# EAGLE design probatio-rotary-16leds_3535 (EAGLE 9.6.2)
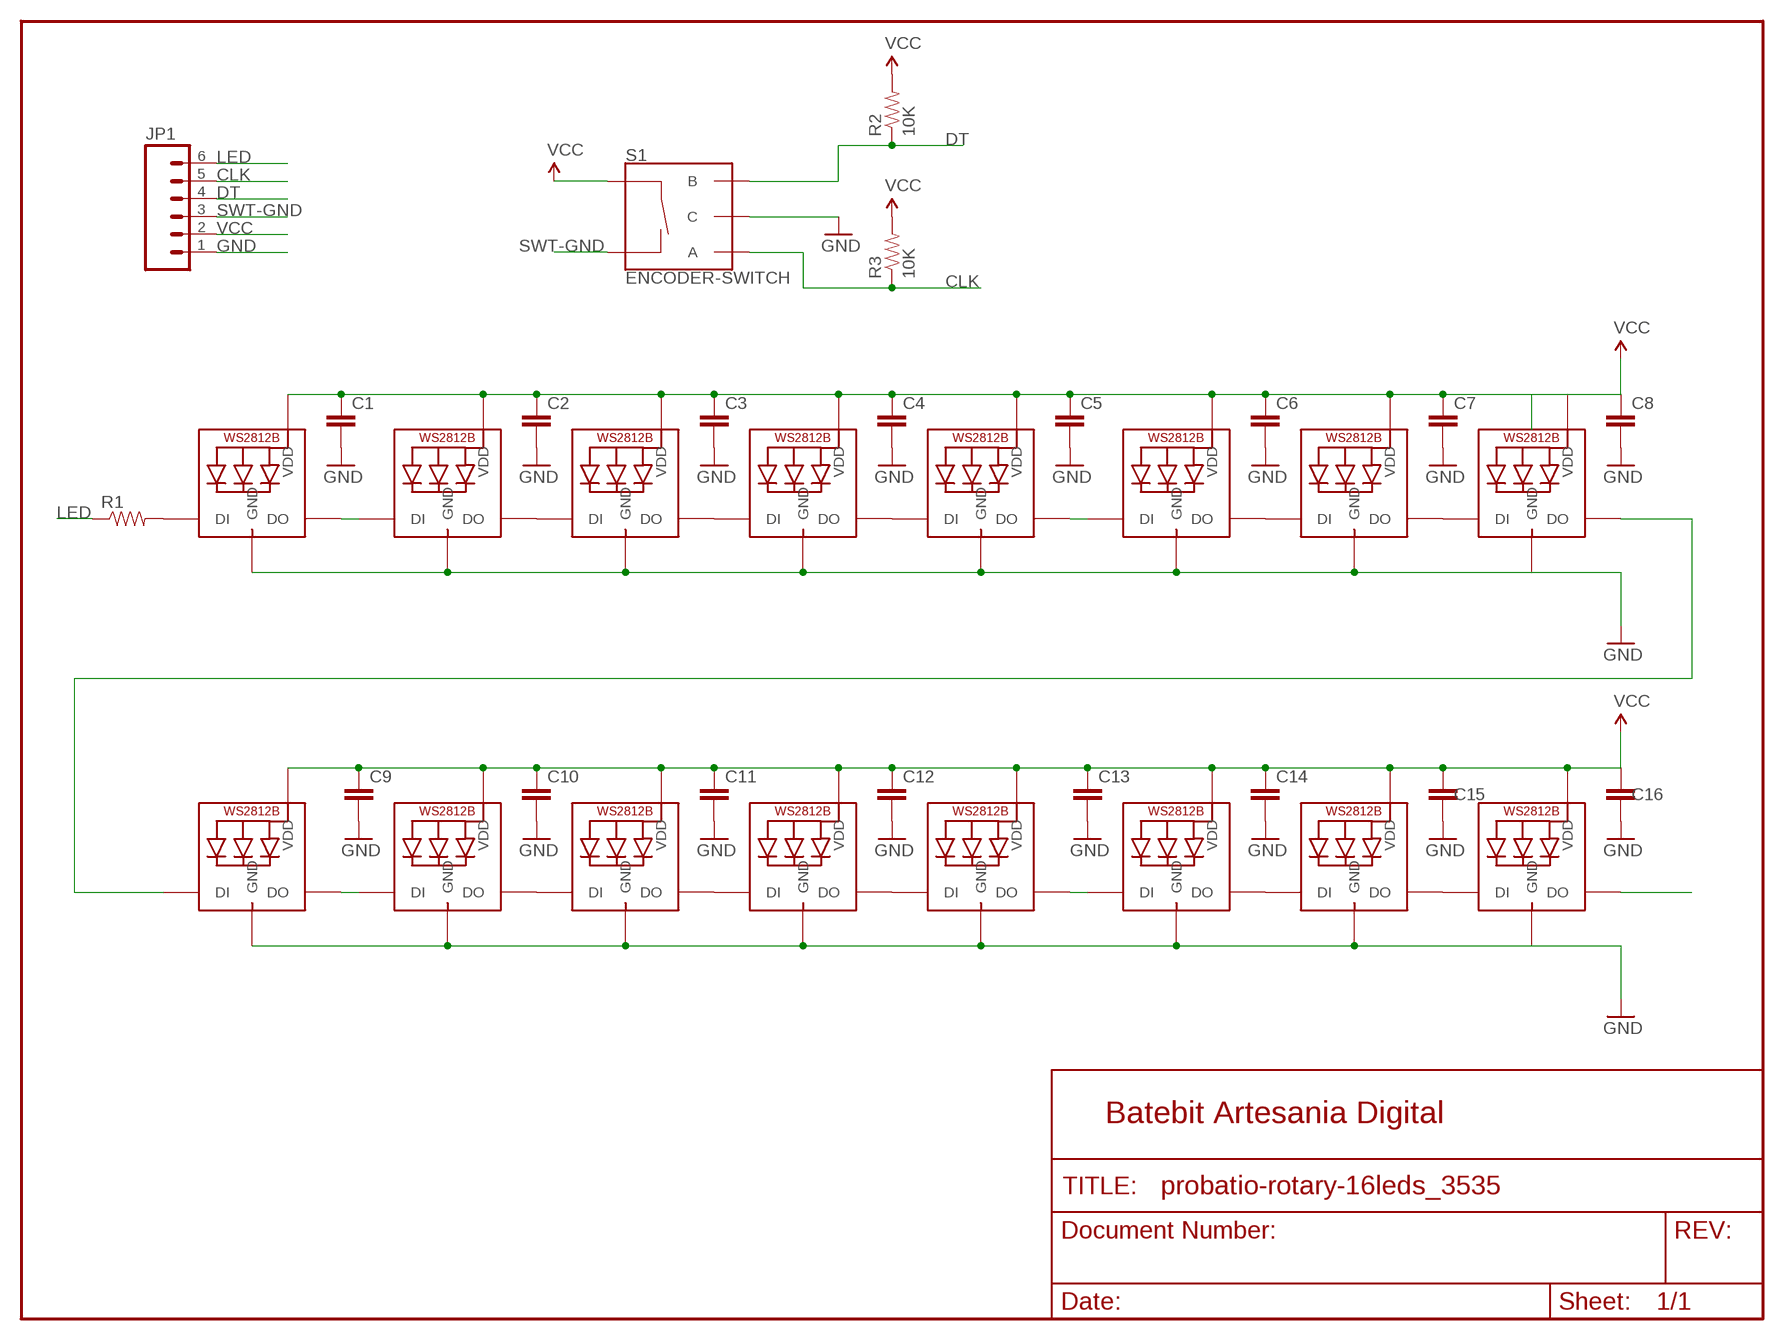
[diagram p0: schematic, sheet 1]

## Parts
C1  CAP0805-CAP  [0805-CAP]
C2  CAP0805-CAP  [0805-CAP]
C3  CAP0805-CAP  [0805-CAP]
C4  CAP0805-CAP  [0805-CAP]
C5  CAP0805-CAP  [0805-CAP]
C6  CAP0805-CAP  [0805-CAP]
C7  CAP0805-CAP  [0805-CAP]
C8  CAP0805-CAP  [0805-CAP]
C9  CAP0805-CAP  [0805-CAP]
C10  CAP0805-CAP  [0805-CAP]
C11  CAP0805-CAP  [0805-CAP]
C12  CAP0805-CAP  [0805-CAP]
C13  CAP0805-CAP  [0805-CAP]
C14  CAP0805-CAP  [0805-CAP]
C15  CAP0805-CAP  [0805-CAP]
C16  CAP0805-CAP  [0805-CAP]
JP1  M06SILK_FEMALE_PTH  [1X06]
LED1  WS2812B3535  [LED3535]
LED2  WS2812B3535  [LED3535]
LED3  WS2812B3535  [LED3535]
LED4  WS2812B3535  [LED3535]
LED5  WS2812B3535  [LED3535]
LED6  WS2812B3535  [LED3535]
LED7  WS2812B3535  [LED3535]
LED8  WS2812B3535  [LED3535]
LED9  WS2812B3535  [LED3535]
LED10  WS2812B3535  [LED3535]
LED11  WS2812B3535  [LED3535]
LED12  WS2812B3535  [LED3535]
LED13  WS2812B3535  [LED3535]
LED14  WS2812B3535  [LED3535]
LED15  WS2812B3535  [LED3535]
LED16  WS2812B3535  [LED3535]
R1  RESISTOR0805-RES  [0805-RES]
R2  10K  RESISTOR0805-RES  [0805-RES]
R3  10K  RESISTOR0805-RES  [0805-RES]
S1  ENCODER-SWITCH  [ROTARY_ENC_PLAIN]

## Nets
CLK: JP1.5 R3.1 S1.A
DT: JP1.4 R2.1 S1.B
GND [Power]: C1.2 C2.2 C3.2 C4.2 C5.2 C6.2 C7.2 C8.2 C9.2 C10.2 C11.2 C12.2 C13.2 C14.2 C15.2 C16.2 JP1.1 LED1.4(GND) LED2.4(GND) LED3.4(GND) LED4.4(GND) LED5.4(GND) LED6.4(GND) LED7.4(GND) LED8.4(GND) LED9.4(GND) LED10.4(GND) LED11.4(GND) LED12.4(GND) LED13.4(GND) LED14.4(GND) LED15.4(GND) LED16.4(GND) S1.C
LED: JP1.6 R1.1
N$1: LED1.3(DO) LED2.1(DI)
N$2: LED2.3(DO) LED3.1(DI)
N$3: LED3.3(DO) LED4.1(DI)
N$4: LED5.3(DO) LED6.1(DI)
N$5: LED6.3(DO) LED7.1(DI)
N$6: LED7.3(DO) LED8.1(DI)
N$7: LED4.3(DO) LED5.1(DI)
N$8: LED9.3(DO) LED10.1(DI)
N$9: LED10.3(DO) LED11.1(DI)
N$10: LED11.3(DO) LED12.1(DI)
N$11: LED13.3(DO) LED14.1(DI)
N$12: LED14.3(DO) LED15.1(DI)
N$13: LED15.3(DO) LED16.1(DI)
N$14: LED12.3(DO) LED13.1(DI)
N$15: LED8.3(DO) LED9.1(DI)
N$16: LED16.3(DO)
N$17: LED1.1(DI) R1.2
SWT-GND: JP1.3 S1.SW-
VCC [Power]: C1.1 C2.1 C3.1 C4.1 C5.1 C6.1 C7.1 C8.1 C9.1 C10.1 C11.1 C12.1 C13.1 C14.1 C15.1 C16.1 JP1.2 LED1.2(VDD) LED2.2(VDD) LED3.2(VDD) LED4.2(VDD) LED5.2(VDD) LED6.2(VDD) LED7.2(VDD) LED8.2(VDD) LED9.2(VDD) LED10.2(VDD) LED11.2(VDD) LED12.2(VDD) LED13.2(VDD) LED14.2(VDD) LED15.2(VDD) LED16.2(VDD) R2.2 R3.2 S1.SW+

## Notes on the sheet
- Batebit Artesania Digital

## Library data of the parts
C1-C16 = Batebit:CAP: Capacitor Standard 0603 ceramic capacitor, and 0.1" leaded capacitor.
JP1 = Batebit:M06: Header 6 Standard 6-pin 0.1" header. Use with straight break away headers (SKU : PRT-00116), right angle break away headers (PRT-00553), swiss pins (PRT-00743), machine pins (PRT-00117), and female headers (PRT-00115). Molex polarized connector foot print use with SKU : PRT-08094 with associated crimp pins and housings. NOTES ON THE VARIANTS LOCK and LOCK_LONGPADS... This footprint was designed to help hold the alignment of a through-hole component (i.e. 6-pin header) while soldering it into place. You may notice that each hole has been shifted either up or down by 0.005 of an inch from it's more standard position (which is a perfectly straight line). This slight alteration caused the pins (the squares in the middle) to touch the edges of the holes. Because they are alternating, it causes a "brace" to hold the component in place. 0.005 has proven to be the perfect amount of "off-center" position when using our standard breakaway headers. Although looks a little odd when you look at the bare footprint, once you have a header in there, the alteration is very hard to notice. Also,if you push a header all the way into place, it is covered up entirely on the bottom side. This idea of altering the position of holes to aid alignment will be further integrated into the Sparkfun Library for other footprints. It can help hold any component with 3 or more connection pins.; PROD_ID: CONN-08437
LED1-LED16 = Batebit:WS2812B
R1-R3 = Batebit:RESISTOR: Resistor Basic schematic elements and footprints for 0603, 1206, and PTH resistors.
S1 = Batebit:ENCODER-SWITCH: Rotary Encoder w/ Select Switch Encoders rotate similarly to potentiometers, but they’re different from potentiometers in that an encoder has full rotation without limits. They output gray code so that you can tell how much and in which direction the encoder has been turned. This encoder includes a push-down select switch built into the shaft. SparkFun Products Rotary Encoder <https://www.sparkfun.com/products/9117> (COM-09117); SF_SKU: COM-09117

## Net classes
0 Default: width 0.254 mm, drill 0.508 mm, clearance 0.203 mm
1 Power: width 0.356 mm, drill 0.508 mm, clearance 0.254 mm
2 LEDPower: width 0.305 mm, drill 0.508 mm, clearance 0.305 mm
3 ButtonSignal: width 0.305 mm, drill 0.508 mm, clearance 0.305 mm

## Board
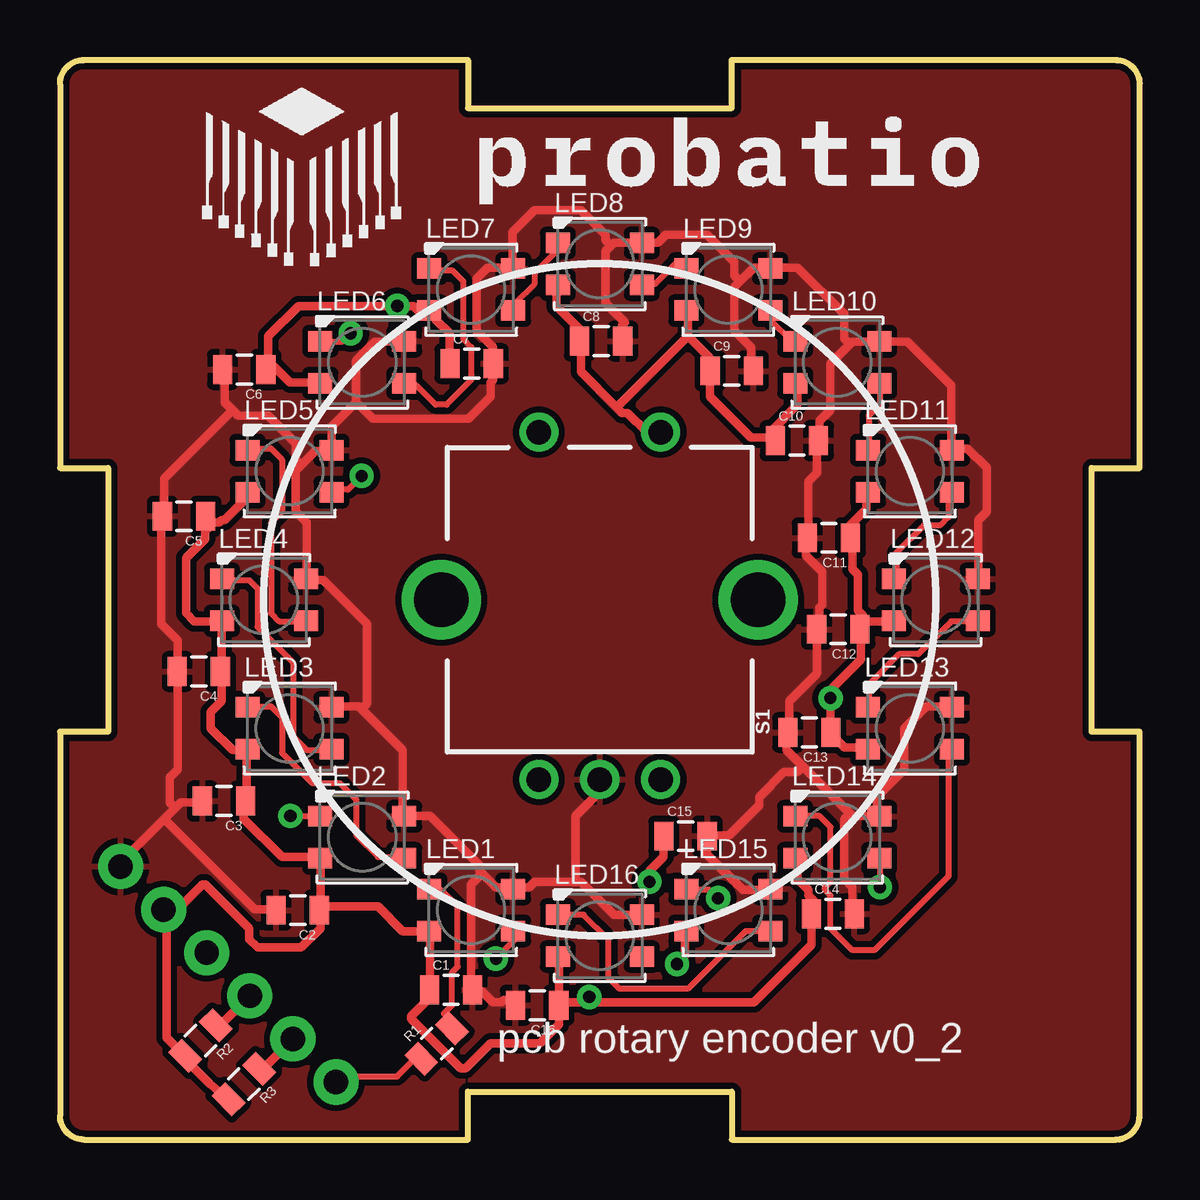
[diagram p1: board, top side]
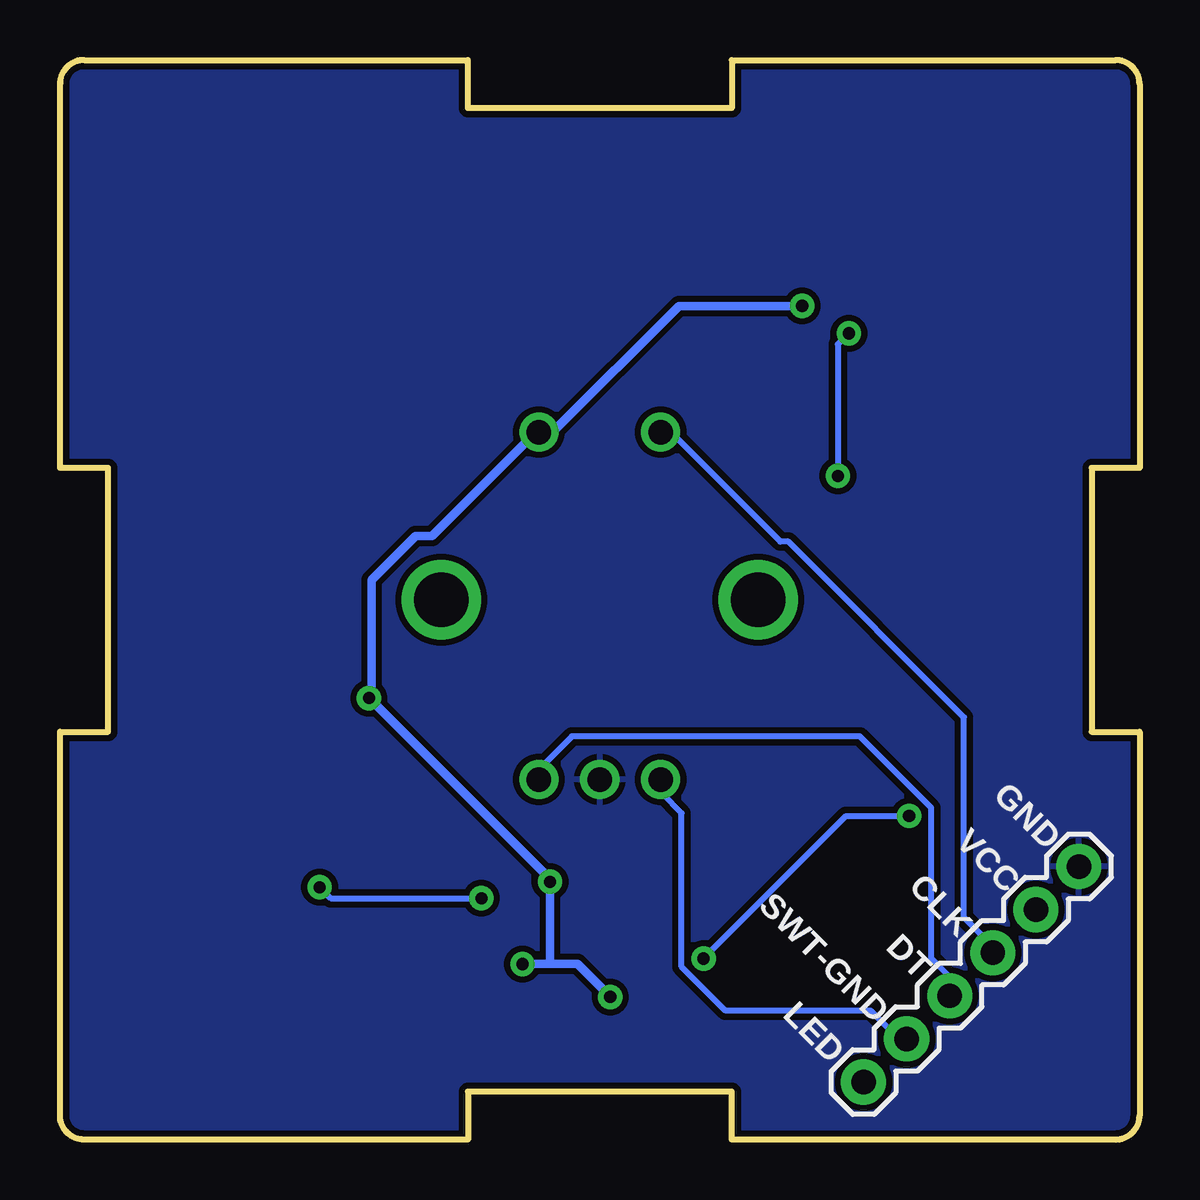
[diagram p2: board, bottom side, seen from below]

Size 45 x 45 mm. Coordinates in mm from the lower left corner, seen from the top.
Outline: 1,0 17,0 17,2 28,2 28,0 44,0 arc90 45,1 45,17 43,17 43,28 45,28 45,44 arc90 44,45 28,45 28,43 17,43 17,45 1,45 arc90 0,44 0,28 2,28 2,17 0,17 0,1 arc90 1,0
Copper layers (1*16): Top 0.035mm / dielectric 1.5mm / Bottom 0.035mm
Design rules "SparkFun": minimum track width 8mil, minimum drill 20mil, track to track 8mil, track to pad 8mil, pad to pad 8mil, via to via 8mil, smd to smd 8mil, copper to edge 10mil, drill to drill 8mil, minimum pad ring 12mil, minimum via ring 10mil, stop-mask expansion 4mil, vias tented up to drill 25mil, thermal gap 10mil

### Footprints (pad centres in the part's own frame; a part is rotated, then mirrored left to right if it is on the bottom)
0805-CAP = smd 0.8 x 1.2: 1 -0.9,0; 2 0.9,0
1X06 = drill 1.016 pad 1.88: 1 0,0; 2 2.54,0; 3 5.08,0; 4 7.62,0; 5 10.16,0; 6 12.7,0
LED3535 = smd 1 x 0.85: 1 -1.75,0.875; 2 -1.75,-0.875; 3 1.75,-0.875; 4 1.75,0.875
0805-RES = smd 0.8 x 1.2: 1 -0.9,0; 2 0.9,0
ROTARY_ENC_PLAIN = drill 1.016: A 7.493,-2.54; B 7.493,2.54; C 7.493,0; SW+ -6.985,2.54; SW- -6.985,-2.54 | drill 2.286: P$3 0,6.604; P$4 0,-6.604

### Placement (x,y rotation side)
C1  16.3,6.24 0 top
C2  9.91,9.56 180 top
C3  6.84,14.11 180 top
C4  5.79,19.51 180 top
C5  5.17,25.98 180 top
C6  7.68,32.1 180 top
C7  17.16,32.34 0 top
C8  22.56,33.28 0 top
C9  28,32.04 0 top
C10  30.72,29.13 0 top
C11  32.05,25.08 180 top
C12  32.44,21.27 180 top
C13  31.24,16.97 180 top
C14  32.22,9.41 0 top
C15  26.08,12.65 0 top
C16  19.89,5.6 180 top
JP1  2.52,11.38 225 bottom
LED1  17.14,9.57 0 top
LED2  12.6,12.6 0 top
LED3  9.57,17.14 0 top
LED4  8.5,22.5 0 top
LED5  9.57,27.86 0 top
LED6  12.6,32.4 0 top
LED7  17.14,35.43 0 top
LED8  22.5,36.5 0 top
LED9  27.86,35.43 0 top
LED10  32.4,32.4 0 top
LED11  35.43,27.86 0 top
LED12  36.5,22.5 0 top
LED13  35.43,17.14 0 top
LED14  32.4,12.6 0 top
LED15  27.86,9.57 0 top
LED16  22.5,8.5 0 top
R1  15.7,4 45 top
R2  5.86,4.12 225 top
R3  7.66,2.31 225 top
S1  22.5,22.5 270 top
U$3  [PROBATIO]  22,40 0 top

### Tracks (layer width: path | path; a pad name or v marks a point on that pad's centre or on a via)
CLK
  Top 0.356: JP1.5 8.46,2.95 R3.1
  Bottom 0.254: S1.A 19.89,14.97 19.89,14.4 19.09,13.6 19.09,7.2 17.26,5.37 11.2,5.37 10.06,4.23 9.72,4.23 JP1.5
DT
  Top 0.356: JP1.4 6.68,4.76 R2.1
  Bottom 0.254: S1.B 25.03,15.09 25.03,15.43 23.66,16.8 11.66,16.8 8.69,13.83 8.69,7.54 8,6.86 8,6.06 JP1.4
GND
  Top 0.356: LED15.4 29.6,10.4 28.46,10.4 26.98,11.89 26.98,12.57 C15.2 27.09,12.69 27.89,12.69 29.15,13.95 29.15,14.29 30.18,15.32 30.75,15.32 30.98,15.54 | 30.98,15.54 30.29,16.23 30.29,16.92 C13.2 30.4,17.14 30.4,18.29 31.55,19.43 C12.2 31.66,21.37 31.66,22.17 31.77,22.29 31.77,23.66 31.09,24.35 31.09,24.92 C11.2 31.2,25.15 31.2,27.43 31.55,27.77 31.55,29.03 C10.2 31.66,29.15 31.66,29.95 32.12,30.4 32.12,32.35 32.92,33.15 | 30.98,15.54 32.92,13.6 | 32.92,13.6 33.03,13.49 34.06,13.49 LED14.4 34.06,13.6 34.06,14.29 35.2,15.43 35.2,17.14 36.12,18.06 37.15,18.06 LED13.4 | C14.2 33.03,9.49 33.03,10.52 32.69,10.86 32.69,13.37 32.92,13.6 | 22.97,37.26 22.75,37.03 22.75,34.86 23.55,34.06 23.43,33.95 23.43,33.38 C8.2 | 22.97,37.26 23.09,37.38 24.23,37.38 LED8.4 24.35,37.38 24.92,37.38 25.26,37.72 26.98,37.72 28.12,36.58 28.12,36.01 28.35,35.78 | 22.97,37.26 22.75,37.49 22.75,37.72 21.72,38.75 19.77,38.75 18.86,37.83 18.86,36.46 LED7.4 18.86,36.35 17.83,36.35 17.37,35.89 17.37,33.72 18.06,33.03 C7.2 18.06,32.23 18.06,31.66 17.95,31.55 17.95,30.98 17.03,30.06 13.03,30.06 12.34,30.75 | 32.92,33.15 33.03,33.26 34.06,33.26 LED10.4 34.29,33.26 35.32,33.26 37.15,31.43 37.15,28.8 LED11.4 37.26,28.8 37.83,28.8 38.63,28 38.63,26.18 38.29,25.83 38.29,23.43 LED12.4 | 32.92,33.15 32.69,33.38 32.69,34.4 30.75,36.35 29.72,36.35 LED9.4 29.49,36.35 28.92,36.35 28.35,35.78 | 28.35,35.78 28.12,35.55 28.12,33.72 28.8,33.03 28.8,32.12 C9.2 | C16.2 18.97,5.6 18.75,5.83 18.52,5.83 18.4,5.71 18.06,5.71 17.6,6.17 17.26,6.17 C1.2 17.14,6.4 17.14,10.63 17.6,11.09
  Top 0.356: 17.6,11.09 18.17,10.52 18.86,10.52 LED1.4 18.97,10.52 19.55,10.52 19.77,10.74 21.49,10.74 | 17.6,11.09 17.49,11.2 17.49,11.43 15.43,13.49 14.4,13.49 LED2.4 14.29,13.6 14.29,16.23 12.57,17.95 | 12.57,17.95 12.46,18.06 11.43,18.06 LED3.4 | 21.49,10.74 21.72,10.74 23.09,9.37 24.23,9.37 LED16.4 | 21.49,10.74 21.49,13.49 22.4,14.4 22.4,14.97 S1.C | 10.06,28.12 10.63,28.69 11.32,28.69 LED5.4 11.32,28.8 11.32,29.72 12.34,30.75 | 10.06,28.12 9.83,27.89 9.83,26.18 10.29,25.72 10.29,23.43 LED4.4 10.4,23.32 10.97,23.32 12.8,21.49 12.8,18.17 12.57,17.95 | 12.34,30.75 12.34,32.46 13.14,33.26 14.29,33.26 LED6.4 | 7.2,30.4 7.43,30.18 8.69,30.18 9.83,29.03 9.83,28.35 10.06,28.12 | 7.2,30.4 6.86,30.75 6.86,32 C6.2 | 4.34,13.37 2.63,11.66 2.63,11.43 JP1.1 | 4.34,13.37 4.8,13.83 | 4.8,13.83 5.03,14.06 5.83,14.06 C3.2 | 4.8,13.83 4.57,14.06 4.57,15.09 4.92,15.43 4.92,19.43 C4.2 4.92,19.66 4.92,20.8 4.23,21.49 4.23,25.95 C5.2 4.34,26.06 4.34,27.55 7.2,30.4 | 4.34,13.37 8.12,9.6 8.91,9.6 C2.2
  pour Bottom (isolate 0.127): 1,0 0,1 0,17 2,17 2,28 0,28 0,44 1,45 17,45 17,43 28,43 28,45 44,45 45,44 45,28 43,28 43,17 45,17 45,1 44,0 28,0 28,2 17,2 17,0
  pour Top (isolate 0.127): 1,0 0,1 0,17 2,17 2,28 0,28 0,44 1,45 17,45 17,43 28,43 28,45 44,45 45,44 45,28 43,28 43,17 45,17 45,1 44,0 28,0 28,2 17,2 17,0
LED
  Top 0.254: R1.1 14.97,3.31 14.74,3.31 14.06,2.63 11.77,2.63 11.54,2.4 JP1.6
N$1  (via drill 0.51)
  Top 0.254: v9.6,13.49 10.74,13.49 LED2.1 | v18.17,7.54 18.97,8.34 18.97,8.69 LED1.3
  Bottom 0.254: v9.6,13.49 12.23,13.49 v18.17,7.54
N$2
  Top 0.254: LED2.3 14.29,11.77 13.26,11.77 12.34,12.69 12.34,14.17 11.66,14.86 10.52,14.86 9.26,16.12 9.26,17.6 8.8,18.06 7.89,18.06 LED3.1
N$3
  Top 0.254: LED3.3 11.32,16.23 10.29,16.23 9.72,16.8 9.72,19.89 8.23,21.37 8.23,22.97 7.89,23.32 6.86,23.32 LED4.1
N$4  (via drill 0.51)
  Top 0.254: v12.57,27.66 12,27.09 11.43,27.09 LED5.3 | v12.12,33.6 11.77,33.26 LED6.1
  Bottom 0.254: v12.57,27.66 12.57,33.15 v12.12,33.6
N$5
  Top 0.254: LED6.3 14.4,31.43 14.86,31.43 15.66,30.63 16.12,30.63 17.14,31.66 17.14,33.03 16.8,33.38 16.8,35.78 16.34,36.23 15.43,36.23 LED7.1
N$6
  Top 0.254: LED7.3 18.97,34.63 18.97,34.86 19.77,35.66 19.77,36.12 20.69,37.03 20.69,37.26 LED8.1
N$7
  Top 0.254: LED4.3 10.17,21.6 9.14,21.6 8.8,21.95 8.8,25.72 9.26,26.18 9.26,28.35 8.8,28.8 7.89,28.8 LED5.1
N$8
  Top 0.254: LED9.3 29.72,34.52 29.72,34.06 30.4,33.38 30.63,33.38 LED10.1
N$9
  Top 0.254: LED11.1 33.72,28.8 33.72,30.18 34.18,30.63 34.18,31.43 LED10.3
N$10
  Top 0.254: LED12.1 34.86,23.43 34.86,24.46 36.01,25.6 36.69,25.6 37.03,25.95 37.03,26.86 37.15,26.98 LED11.3
N$11
  Top 0.254: LED14.1 30.75,13.49 31.66,13.49 32.12,13.03 32.12,10.74 31.89,10.52 31.89,10.4 32.12,10.17 32.12,8.8 33.03,7.89 33.95,7.89 37.03,10.97 37.03,16.12 37.15,16.23 LED13.3
N$12  (via drill 0.51)
  Top 0.254: v27.43,10.06 27.09,10.4 26.18,10.4 LED15.1 | v34.18,10.52 34.18,11.66 LED14.3
  Bottom 0.254: v27.43,10.06 33.72,10.06 v34.18,10.52
N$13
  Top 0.254: LED16.1 20.8,9.37 21.83,9.37 22.86,8.34 22.86,6.74 23.32,6.29 26.18,6.29 28.57,8.69 29.6,8.69 LED15.3
N$14
  Top 0.254: LED13.1 33.72,18.06 33.72,18.97 34.98,20.23 35.78,20.23 37.15,21.6 38.18,21.6 LED12.3
N$15
  Top 0.254: LED8.3 24.35,35.66 24.8,35.66 25.72,36.58 25.83,36.58 26.06,36.35 LED9.1
N$17
  Top 0.254: LED1.1 15.43,10.4 15.89,10.4 16.57,9.72 16.57,7.2 16.34,6.97 16.34,5.6 16,5.26 16.23,5.03 16.23,4.69 R1.2
SWT-GND
  Bottom 0.254: S1.SW- 19.89,29.38 19.43,29.38 14.97,24.92 14.63,24.92 7.32,17.6 7.32,9.26 6.17,8.12 6.17,7.89 JP1.3
VCC  (via drill 0.51)
  Top 0.356: R2.2 5.62,2.95 6.25,2.33 R3.2 | 5.2,3.49 R2.2 | 4.34,9.49 JP1.2 4.46,9.6 | C2.1 10.86,9.6 10.86,11.66 LED2.2 10.74,11.77 9.26,11.77 7.66,13.37 7.66,14.06 C3.1 7.77,14.17 7.77,16.23 LED3.2 7.66,16.23 7.2,16.23 6.29,17.14 6.29,17.83 6.74,18.29 6.74,19.43 C4.1 6.74,19.55 6.74,21.6 LED4.2 6.63,21.6 5.6,21.6 5.26,21.95 5.26,24.23 6.06,25.03 6.06,25.38 6.29,25.6 C5.1 6.17,25.95 6.4,25.72 6.63,25.72 6.74,25.83 6.86,25.83 7.77,26.75 7.77,26.98 LED5.2 | C2.1 10.97,9.72 13.26,9.72 14.29,8.69 15.32,8.69 LED1.2 15.43,8.69 15.43,6.29 C1.1 15.32,6.17 15.32,5.83 14.63,5.14 14.63,5.03 16.69,2.97 16.92,2.97 17.95,4 20,4 20.8,4.8 20.8,5.49 C16.1 | 4.46,9.6 4.92,9.6 5.94,10.63 6.06,10.63 7.89,8.8 7.89,8.34 8.23,8 10.06,8 10.86,8.8 10.86,9.49 C2.1 | LED6.2 10.74,31.55 9.6,31.55 8.91,32.23 8.8,32.23 8.69,32.12 C6.1 8.69,32.35 8.69,33.49 9.94,34.75 v14.06,34.75 14.74,34.75 14.97,34.52 15.32,34.52 LED7.2 15.43,34.52 15.66,34.29 15.66,34.18 16.23,33.6 16.23,32.35 C7.1 | LED10.2 30.75,31.43 30.75,30.63 29.72,29.6 29.72,29.15 C10.1 29.6,29.26 28.8,29.26 27.09,30.98 27.09,31.89 C9.1 27.09,32.12 27.09,32.58 26.18,33.49 | 26.18,33.49 26.18,34.52 LED9.2 | LED8.2 20.69,35.55 20.69,34.75 21.72,33.72 21.72,33.38 C8.1 21.72,33.15 21.72,32 23.2,30.52 | 23.2,30.52 23.43,30.29 23.66,30.29 24.46,29.49 S1.SW+ | 23.2,30.52 26.18,33.49 | LED13.2 33.6,16.34 32.69,16.34 32.12,16.92 C13.1 32.12,17.14 v32.12,18.4 32.12,18.75 33.38,20 33.38,21.14 C12.1 | LED12.2 34.75,21.6 33.6,21.6 33.38,21.37 C12.1 | LED11.2 33.6,26.98 33.6,26.29 32.92,25.6 32.92,25.15 C11.1 33.03,25.03 33.03,23.77 33.26,23.55 33.26,22.06 33.49,21.83 33.49,21.72 C12.1
  Top 0.356: LED14.2 30.75,11.66 30.75,10.86 31.2,10.4 31.2,10.17 31.43,9.94 31.43,9.49 C14.1 31.32,9.26 31.32,8.12 28.92,5.71 22.29,5.71 v22.06,5.94 21.83,5.71 20.92,5.71 C16.1 | LED16.2 20.8,7.54 20.8,5.6 C16.1 | v25.72,7.32 26.06,7.66 26.06,8.69 LED15.2 | v24.57,10.74 24.57,11.2 25.15,11.77 25.15,12.57 C15.1 | R2.2 4.46,4.25 4.46,9.6
  Bottom 0.356: v14.06,34.75 19.2,34.75 24.46,29.49 S1.SW+ 25.15,29.38 25.38,29.15 25.49,29.15 29.49,25.15 30.18,25.15 32,23.32 32,18.52 v32.12,18.4 24.57,10.86 v24.57,10.74 24.57,7.32 | 24.57,7.32 23.43,7.32 v22.06,5.94 | 24.57,7.32 v25.72,7.32

### Text on the board
tPlace: pcb rotary encoder v0_2
bPlace: GND | VCC | CLK | DT | SWT-GND | LED
Document: J. Tragtenberg | N. Seidle